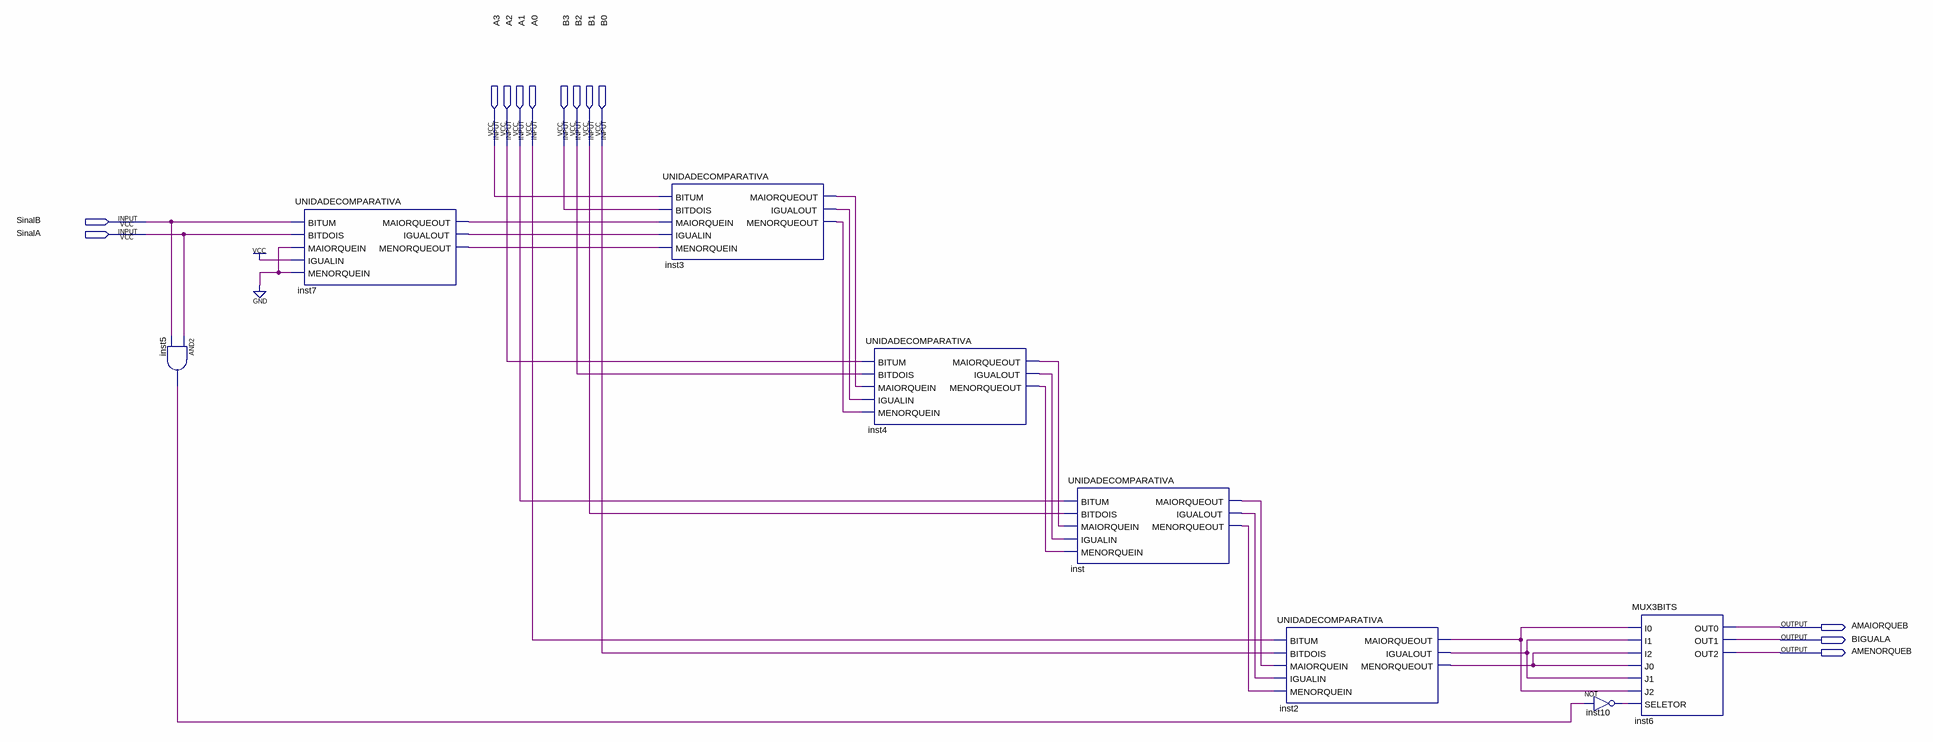
[diagram p0: schematic sheet]
// Quartus schematic COMPARADOR4BITS.bdf as structural Verilog: 8 symbols, 13 pins
module COMPARADOR4BITS (
  input  A3,
  input  A2,
  input  A1,
  input  A0,
  input  B3,
  input  B2,
  input  B1,
  input  B0,
  input  SinalB,
  input  SinalA,
  output AMAIORQUEB,
  output BIGUALA,
  output AMENORQUEB
);

  wire inst2_igualout, inst2_maiorqueout, inst2_menorqueout, inst3_igualout, inst3_maiorqueout,
       inst3_menorqueout, inst4_igualout, inst4_maiorqueout, inst4_menorqueout, inst5_out, inst7_igualout,
       inst7_maiorqueout, inst7_menorqueout, inst10_out, inst_igualout, inst_maiorqueout, inst_menorqueout;

  and inst5 (inst5_out, SinalA, SinalB);
  UNIDADECOMPARATIVA inst7 (
    .BITUM(SinalB), .BITDOIS(SinalA), .MAIORQUEIN(1'b0), .IGUALIN(1'b1), .MENORQUEIN(1'b0),
    .MAIORQUEOUT(inst7_maiorqueout), .IGUALOUT(inst7_igualout), .MENORQUEOUT(inst7_menorqueout));
  UNIDADECOMPARATIVA inst3 (
    .BITUM(A3), .BITDOIS(B3), .MAIORQUEIN(inst7_maiorqueout), .IGUALIN(inst7_igualout),
    .MENORQUEIN(inst7_menorqueout), .MAIORQUEOUT(inst3_maiorqueout), .IGUALOUT(inst3_igualout),
    .MENORQUEOUT(inst3_menorqueout));
  UNIDADECOMPARATIVA inst4 (
    .BITUM(A2), .BITDOIS(B2), .MAIORQUEIN(inst3_maiorqueout), .IGUALIN(inst3_igualout),
    .MENORQUEIN(inst3_menorqueout), .MAIORQUEOUT(inst4_maiorqueout), .IGUALOUT(inst4_igualout),
    .MENORQUEOUT(inst4_menorqueout));
  UNIDADECOMPARATIVA inst (
    .BITUM(A1), .BITDOIS(B1), .MAIORQUEIN(inst4_maiorqueout), .IGUALIN(inst4_igualout),
    .MENORQUEIN(inst4_menorqueout), .MAIORQUEOUT(inst_maiorqueout), .IGUALOUT(inst_igualout),
    .MENORQUEOUT(inst_menorqueout));
  UNIDADECOMPARATIVA inst2 (
    .BITUM(A0), .BITDOIS(B0), .MAIORQUEIN(inst_maiorqueout), .IGUALIN(inst_igualout),
    .MENORQUEIN(inst_menorqueout), .MAIORQUEOUT(inst2_maiorqueout), .IGUALOUT(inst2_igualout),
    .MENORQUEOUT(inst2_menorqueout));
  not inst10 (inst10_out, inst5_out);
  MUX3BITS inst6 (
    .I0(inst2_maiorqueout), .I1(inst2_igualout), .I2(inst2_menorqueout), .J0(inst2_menorqueout),
    .J1(inst2_igualout), .J2(inst2_maiorqueout), .SELETOR(inst10_out), .OUT0(AMAIORQUEB), .OUT1(BIGUALA),
    .OUT2(AMENORQUEB));
endmodule
